# EAGLE design neon-lamb-spec-calibration (EAGLE 6.5.0)
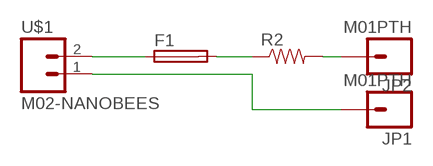
[diagram p0: schematic, sheet 1]

## Parts
F1  GSH15  [GSH15]
JP1  M01PTH  [1X01]
JP2  M01PTH  [1X01]
R2  RESISTORPTH-1W  [AXIAL-0.6]
U$1  M02-NANOBEES  [M02-NANOBEES]

## Nets
N$1: F1.1 U$1.2
N$2: JP2.1 R2.P$2
N$3: JP1.1 U$1.1
N$4: F1.2 R2.P$1

## Library data of the parts
F1 = fuse:GSH15: FUSE HOLDER grid 15mm, 19649 Wickmann; MPN: 64900001039; OC_FARNELL: 1271673; OC_NEWARK: 02P0318
JP1 JP2 = SparkFun-Connectors:M01: Header 1 Standard 1-pin 0.1" header. Use with straight break away headers (SKU : PRT-00116), right angle break away headers (PRT-00553), swiss pins (PRT-00743), machine pins (PRT-00117), and female headers (PRT-00115).
R2 = SparkFun-Resistors:RESISTOR: Resistor Basic schematic elements and footprints for 0603, 1206, and PTH resistors.
U$1 = SparkFun-Connectors:M02-NANOBEES

## Board
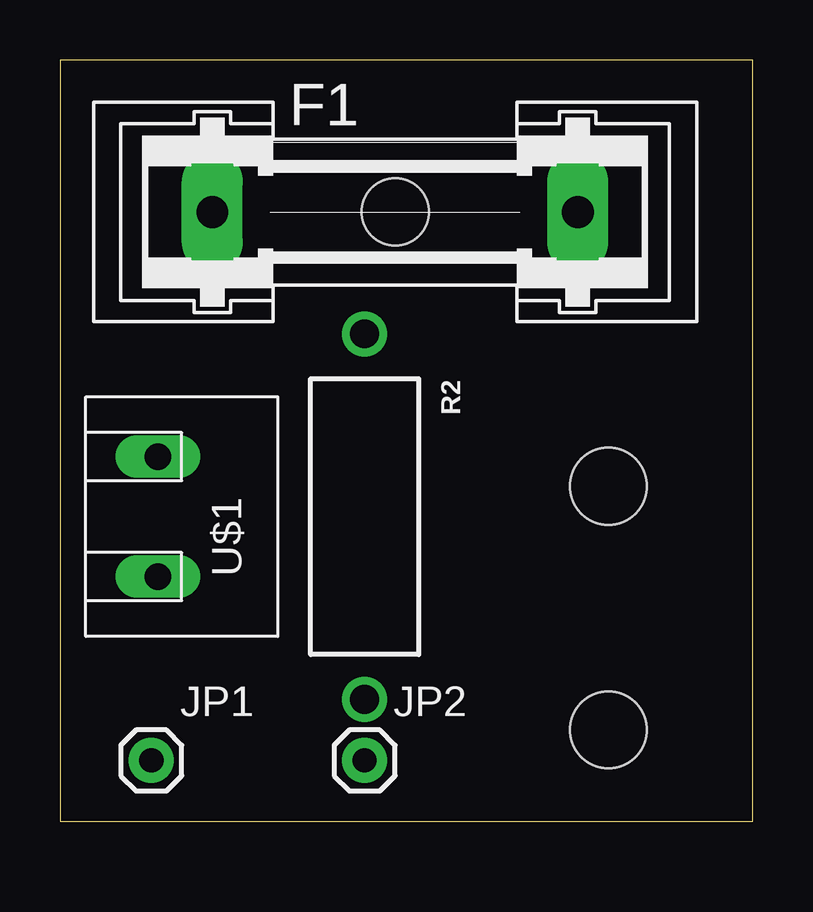
[diagram p1: board, top side]
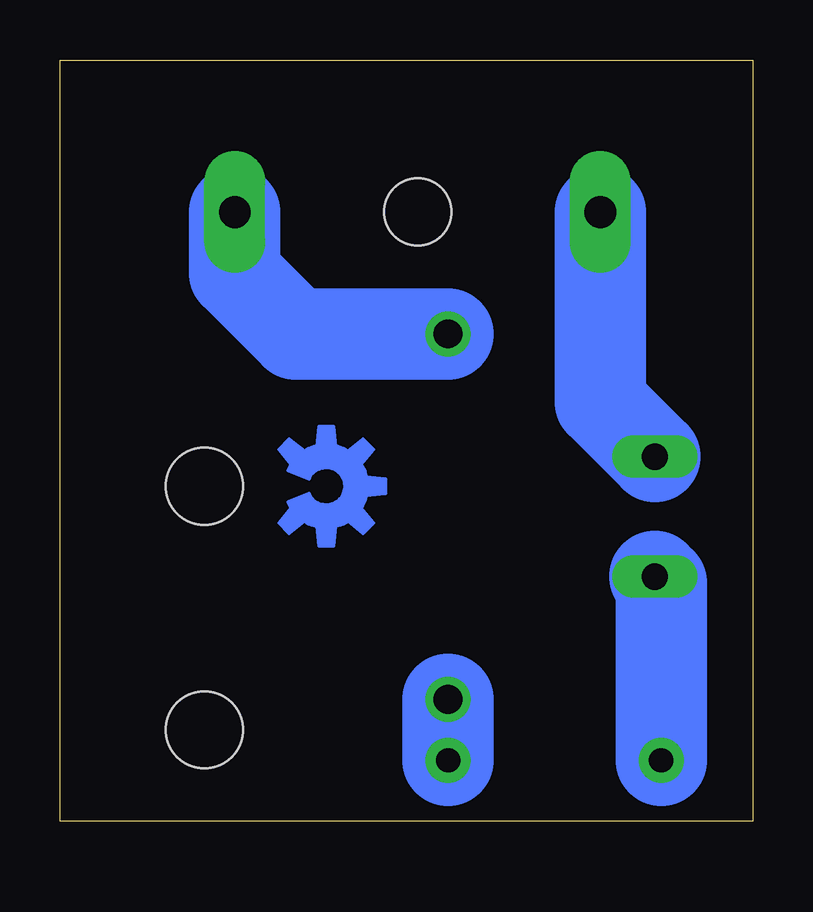
[diagram p2: board, bottom side, seen from below]

Size 28.88 x 31.74 mm. Coordinates in mm from the lower left corner, seen from the top.
Outline: 0,0 28.88,0 28.88,31.74 0,31.74 0,0
Copper layers (1*16): Top 0.035mm / dielectric 1.5mm / Bottom 0.035mm
Design rules "default": minimum track width 10mil, minimum drill 24mil, track to track 8mil, track to pad 8mil, pad to pad 8mil, via to via 8mil, smd to smd 8mil, copper to edge 40mil, drill to drill 8mil, minimum pad ring 10mil, minimum via ring 8mil, stop-mask expansion 4mil, vias tented up to drill 0mil, thermal gap 10mil
Holes 3.2 mm at 22.86,3.81 22.86,13.97

### Footprints (pad centres in the part's own frame; a part is rotated, then mirrored left to right if it is on the bottom)
GSH15 = drill 1.321 pad 2.54 long: 1 -7.62,0; 2 7.62,0 | hole 2.794: 0,0
1X01 = drill 1.016 pad 1.88: 1 0,0
AXIAL-0.6 = drill 1.2 pad 1.88: P$1 -7.62,0; P$2 7.62,0
M02-NANOBEES = drill 1.1 pad 1.778 long: 1 -2.5,1; 2 2.5,1

### Placement (x,y rotation side)
F1  13.97,25.4 0 top
JP1  3.81,2.54 0 top
JP2  12.7,2.54 0 top
R2  12.7,12.7 270 top
U$1  5.08,12.7 90 top
U$2  [OSHW-LOGO-M]  17.78,13.97 90 top

### Tracks (layer width: path | path; a pad name or v marks a point on that pad's centre or on a via)
N$1
  Bottom 3.81: U$1.2 6.35,17.47 F1.1
N$2
  Bottom 3.81: R2.P$2 JP2.1
N$3
  Bottom 3.81: U$1.1 3.81,9.93 JP1.1
N$4
  Bottom 3.81: F1.2 21.59,22.86 19.05,20.32 R2.P$1